# Altium schematic sheet pa.SchDoc
size Legal; CompanyName: Signal Laboratories, Inc.; Address1: 3479 Edison Way; Address2: Menlo Park CA 94025; Address3: +1 (877) 778-8435; Address4: siglabs.com; Revision: 1; SheetNumber: 1; SheetTotal: 1
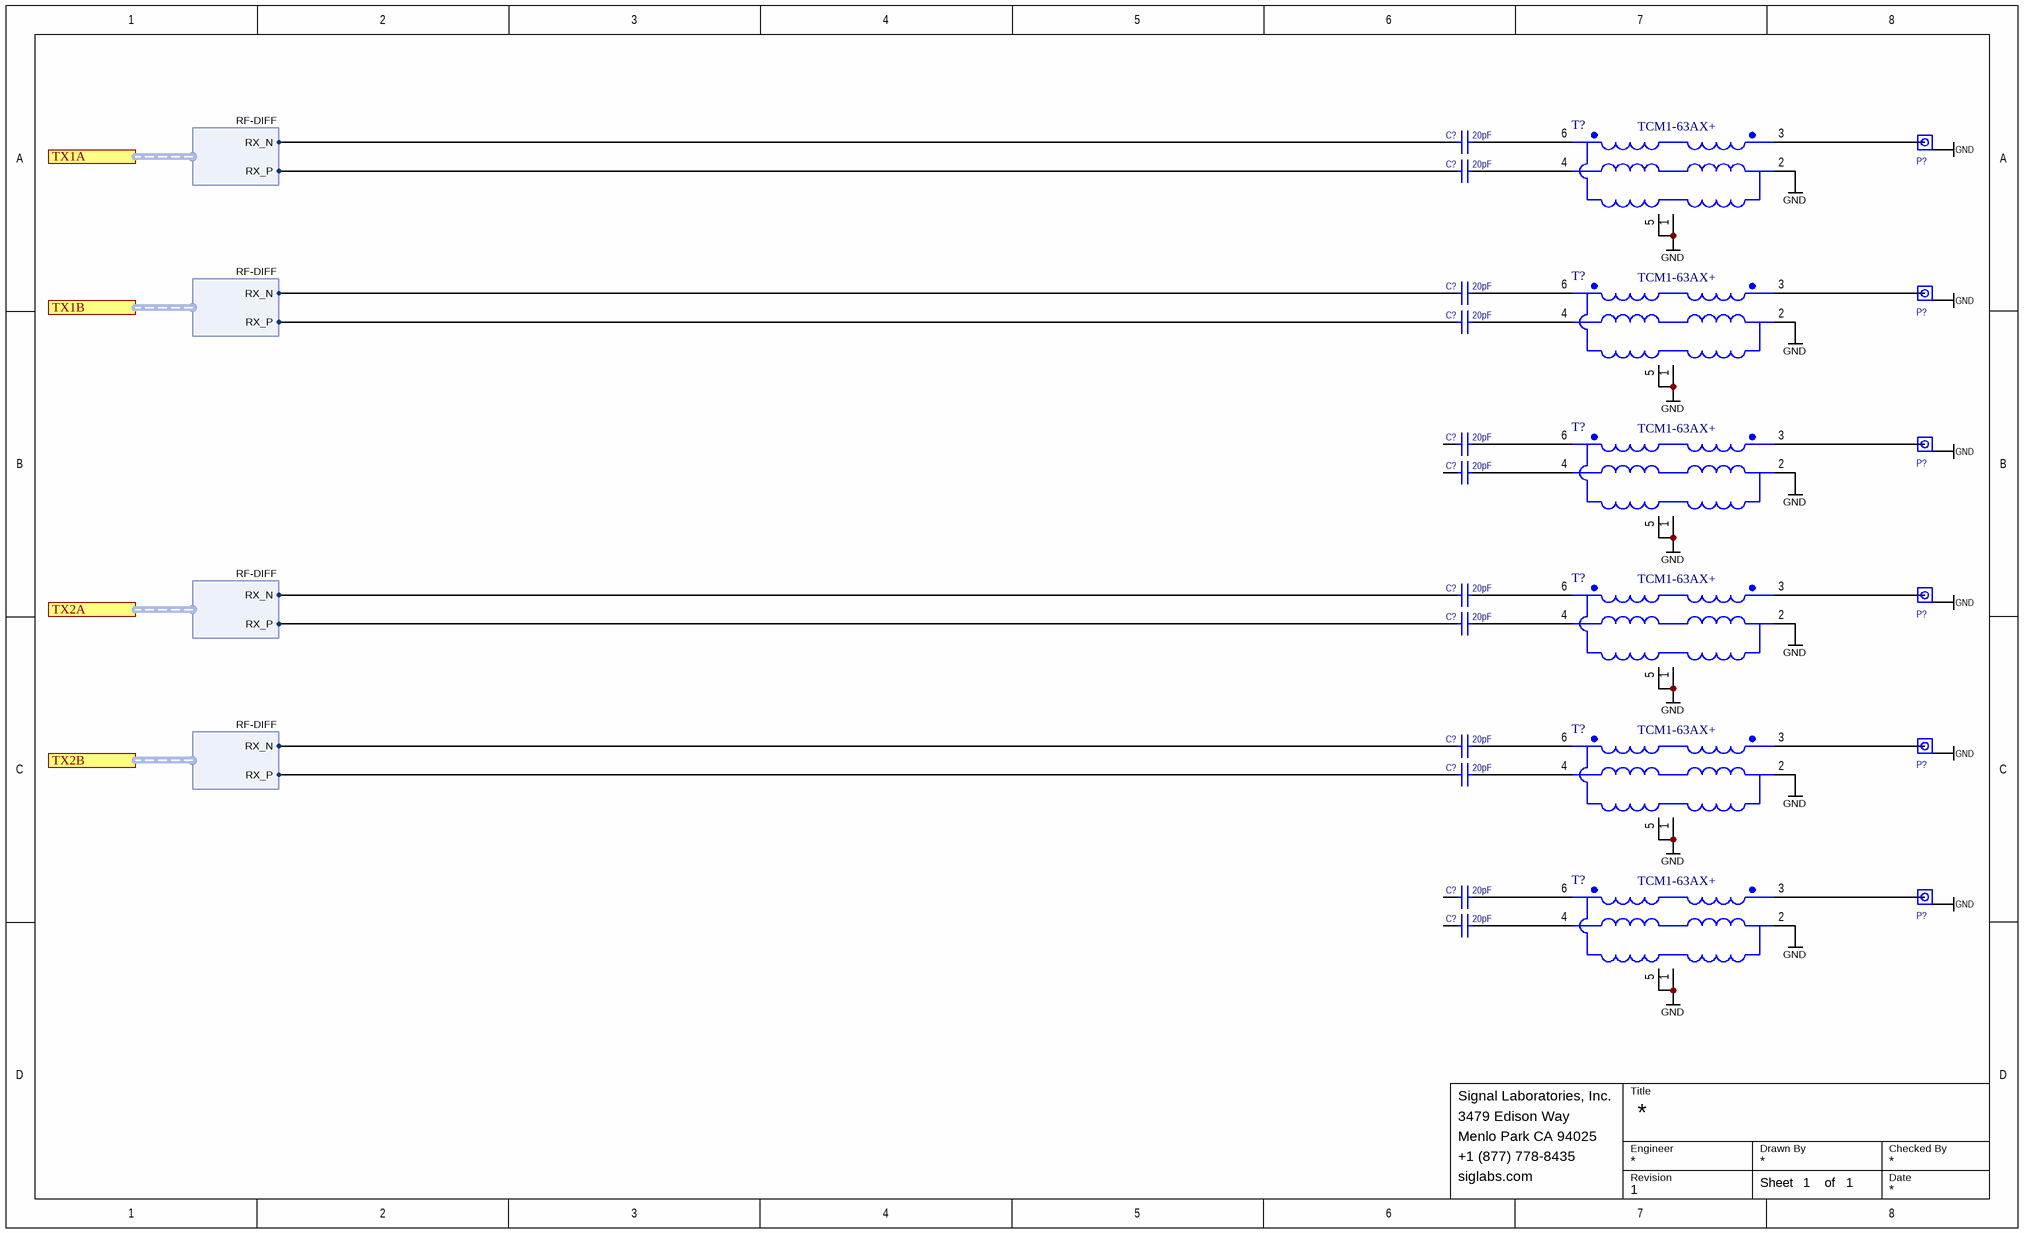
[diagram p0: pa.SchDoc]

## Parts
(Parts that share a designator on the sheet are numbered #1, #2 ... from top to bottom, then left to right.)
C?#1  value 20pF  [0402]  (hidden comment: CBR04C200F5GAC)
C?#2  value 20pF  [0402]  (hidden comment: CBR04C200F5GAC)
C?#3  value 20pF  [0402]  (hidden comment: CBR04C200F5GAC)
C?#4  value 20pF  [0402]  (hidden comment: CBR04C200F5GAC)
C?#5  value 20pF  [0402]  (hidden comment: CBR04C200F5GAC)
C?#6  value 20pF  [0402]  (hidden comment: CBR04C200F5GAC)
C?#7  value 20pF  [0402]  (hidden comment: CBR04C200F5GAC)
C?#8  value 20pF  [0402]  (hidden comment: CBR04C200F5GAC)
C?#9  value 20pF  [0402]  (hidden comment: CBR04C200F5GAC)
C?#10  value 20pF  [0402]  (hidden comment: CBR04C200F5GAC)
C?#11  value 20pF  [0402]  (hidden comment: CBR04C200F5GAC)
C?#12  value 20pF  [0402]  (hidden comment: CBR04C200F5GAC)
P?#1  U.FL-R-SMT(10)  [U.FL-R-SMT(10)]  (value not drawn)
P?#2  U.FL-R-SMT(10)  [U.FL-R-SMT(10)]  (value not drawn)
P?#3  U.FL-R-SMT(10)  [U.FL-R-SMT(10)]  (value not drawn)
P?#4  U.FL-R-SMT(10)  [U.FL-R-SMT(10)]  (value not drawn)
P?#5  U.FL-R-SMT(10)  [U.FL-R-SMT(10)]  (value not drawn)
P?#6  U.FL-R-SMT(10)  [U.FL-R-SMT(10)]  (value not drawn)
T?#1  TCM1-63AX+  [TCM1-63AX+]
T?#2  TCM1-63AX+  [TCM1-63AX+]
T?#3  TCM1-63AX+  [TCM1-63AX+]
T?#4  TCM1-63AX+  [TCM1-63AX+]
T?#5  TCM1-63AX+  [TCM1-63AX+]
T?#6  TCM1-63AX+  [TCM1-63AX+]

## Ports
TX1A (harness RF-DIFF), TX1B (harness RF-DIFF), TX2A (harness RF-DIFF), TX2B (harness RF-DIFF)

## Harnesses
RF-DIFF: RX_N, RX_P

## Nets
GND: P?#1.2(GND) P?#2.2(GND) P?#3.2(GND) P?#4.2(GND) P?#5.2(GND) P?#6.2(GND) T?#1.1 T?#1.2 T?#1.5 T?#2.1 T?#2.2 T?#2.5 T?#3.1 T?#3.2 T?#3.5 T?#4.1 T?#4.2 T?#4.5 T?#5.1 T?#5.2 T?#5.5 T?#6.1 T?#6.2 T?#6.5
NetC?#1_1: C?#1.1 ; port TX1A.RX_N
NetC?#1_2: C?#1.2 T?#1.6
NetC?#2_1: C?#2.1 ; port TX1A.RX_P
NetC?#2_2: C?#2.2 T?#1.4
NetC?#3_1: C?#3.1 ; port TX1B.RX_N
NetC?#3_2: C?#3.2 T?#2.6
NetC?#4_1: C?#4.1 ; port TX1B.RX_P
NetC?#4_2: C?#4.2 T?#2.4
NetC?#5_2: C?#5.2 T?#3.6
NetC?#6_2: C?#6.2 T?#3.4
NetC?#7_1: C?#7.1 ; port TX2A.RX_N
NetC?#7_2: C?#7.2 T?#4.6
NetC?#8_1: C?#8.1 ; port TX2A.RX_P
NetC?#8_2: C?#8.2 T?#4.4
NetC?#9_1: C?#9.1 ; port TX2B.RX_N
NetC?#9_2: C?#9.2 T?#5.6
NetC?#10_1: C?#10.1 ; port TX2B.RX_P
NetC?#10_2: C?#10.2 T?#5.4
NetC?#11_2: C?#11.2 T?#6.6
NetC?#12_2: C?#12.2 T?#6.4
NetP?#1_1: P?#1.1(RF) T?#1.3
NetP?#2_1: P?#2.1(RF) T?#2.3
NetP?#3_1: P?#3.1(RF) T?#3.3
NetP?#4_1: P?#4.1(RF) T?#4.3
NetP?#5_1: P?#5.1(RF) T?#5.3
NetP?#6_1: P?#6.1(RF) T?#6.3

Not connected (* = marked no-connect by the designer): C?#5 1; C?#6 1; C?#11 1; C?#12 1

## Notes on the sheet
- Title
- Engineer
- Revision
- Drawn By
- Checked By
- Date
- Sheet
- of

## Library data of the parts
C?#1-C?#12 = CAP 0402: Ceramic Capacitor 20pF ±1% 50V NP0 0402; Manufacturer: Kemet; Tr: -55:125; Voltage: 50V; Manufacturer P/N: CBR04C200F5GAC; Package: 0402; Tolerance: ±1%
P?#1-P?#6 = U.FL-R-SMT(10): Ultra Miniature Coaxial Jack, 50 Ohms; Manufacturer: Hirose; Manufacturer P/N: U.FL-R-SMT(10)
T?#1-T?#6 = TCM1-63AX+: RF Transformer 10-6000KHz; Manufacturer: Mini-Circuits; Manufacturer P/N: TC1-1-13M